# Altium schematic sheet powerSource.SchDoc
size A4
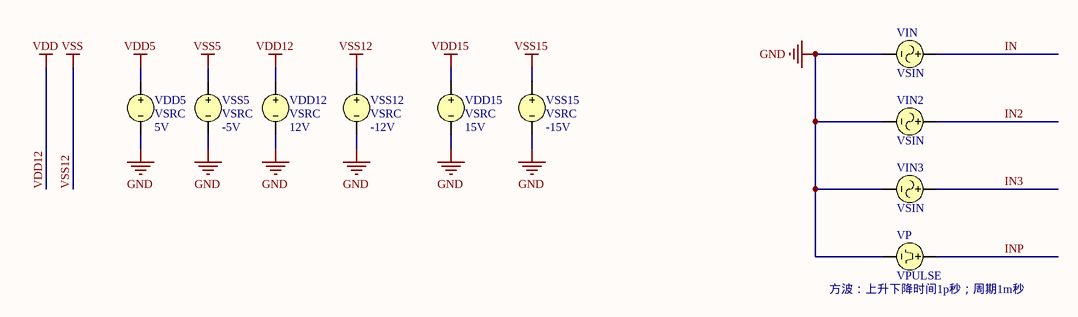
[diagram p0: powerSource.SchDoc]

## Parts
VDD5  VSRC  value 5V
VDD12  VSRC  value 12V
VDD15  VSRC  value 15V
VIN  VSIN
VIN2  VSIN
VIN3  VSIN
VP  VPULSE
VSS5  VSRC  value -5V
VSS12  VSRC  value -12V
VSS15  VSRC  value -15V

## Nets
GND: VDD5.2 VDD12.2 VDD15.2 VIN.2 VIN2.2 VIN3.2 VP.2 VSS5.2 VSS12.2 VSS15.2
VDD5: VDD5.1
VDD12: VDD12.1  [also labelled VDD]
VDD15: VDD15.1
VSS5: VSS5.1
VSS12: VSS12.1  [also labelled VSS]
VSS15: VSS15.1
IN: VIN.1
IN2: VIN2.1
IN3: VIN3.1
INP: VP.1

## Notes on the sheet
- (near VP) 方波：上升下降时间1p秒；周期1m秒

## Library data of the parts
VDD5 VDD12 VDD15 VSS5 VSS12 VSS15 = VSRC: Voltage Source; Note: PCB Footprint - Not required; Published: 8-Jun-2000; LatestRevisionDate: 17-Jul-2002; LatestRevisionNote: Re-released for DXP Platform.; PackageReference: Not Applicable; Publisher: Altium Limited
VIN VIN2 VIN3 = VSIN: Sinusoidal Voltage Source; Note: PCB Footprint - Not required; Published: 8-Jun-2000; LatestRevisionDate: 15-Nov-2004; LatestRevisionNote: Corrected Netlist.; PackageReference: Not Applicable; Publisher: Altium Limited
VP = VPULSE: Pulse Voltage Source; Note: PCB Footprint - Not required; Published: 8-Jun-2000; LatestRevisionDate: 15-Nov-2004; LatestRevisionNote: Corrected Netlist.; PackageReference: Not Applicable; Publisher: Altium Limited